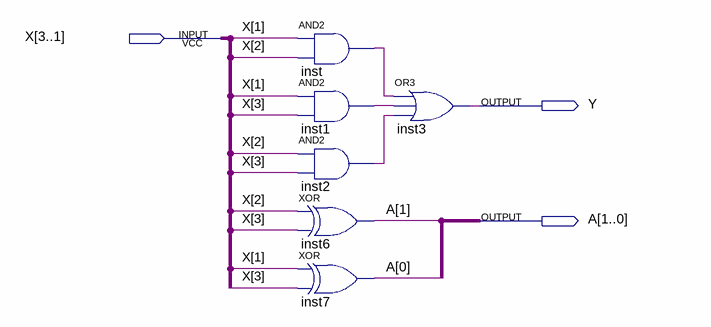
[diagram p0: schematic sheet]
// Quartus schematic maj3_sch.bdf as structural Verilog: 6 symbols, 3 pins
module maj3_sch (
  input  [3:1] X,
  output Y,
  output [1:0] A
);

  wire inst1_out, inst2_out, inst_out;

  and inst (inst_out, X[1], X[2]);
  and inst1 (inst1_out, X[1], X[3]);
  and inst2 (inst2_out, X[2], X[3]);
  xor inst6 (A[1], X[2], X[3]);
  xor inst7 (A[0], X[1], X[3]);
  or inst3 (Y, inst_out, inst1_out, inst2_out);
endmodule
